# Altium schematic sheet INF_Pro_Interface.SchDoc
size A4; Author: Yaokun/Felix Zhang; Organization: Altium Limited; Address1: 21A144; Address2: Harbin Engineering University; Address3: Harbin; Address4: CHINA
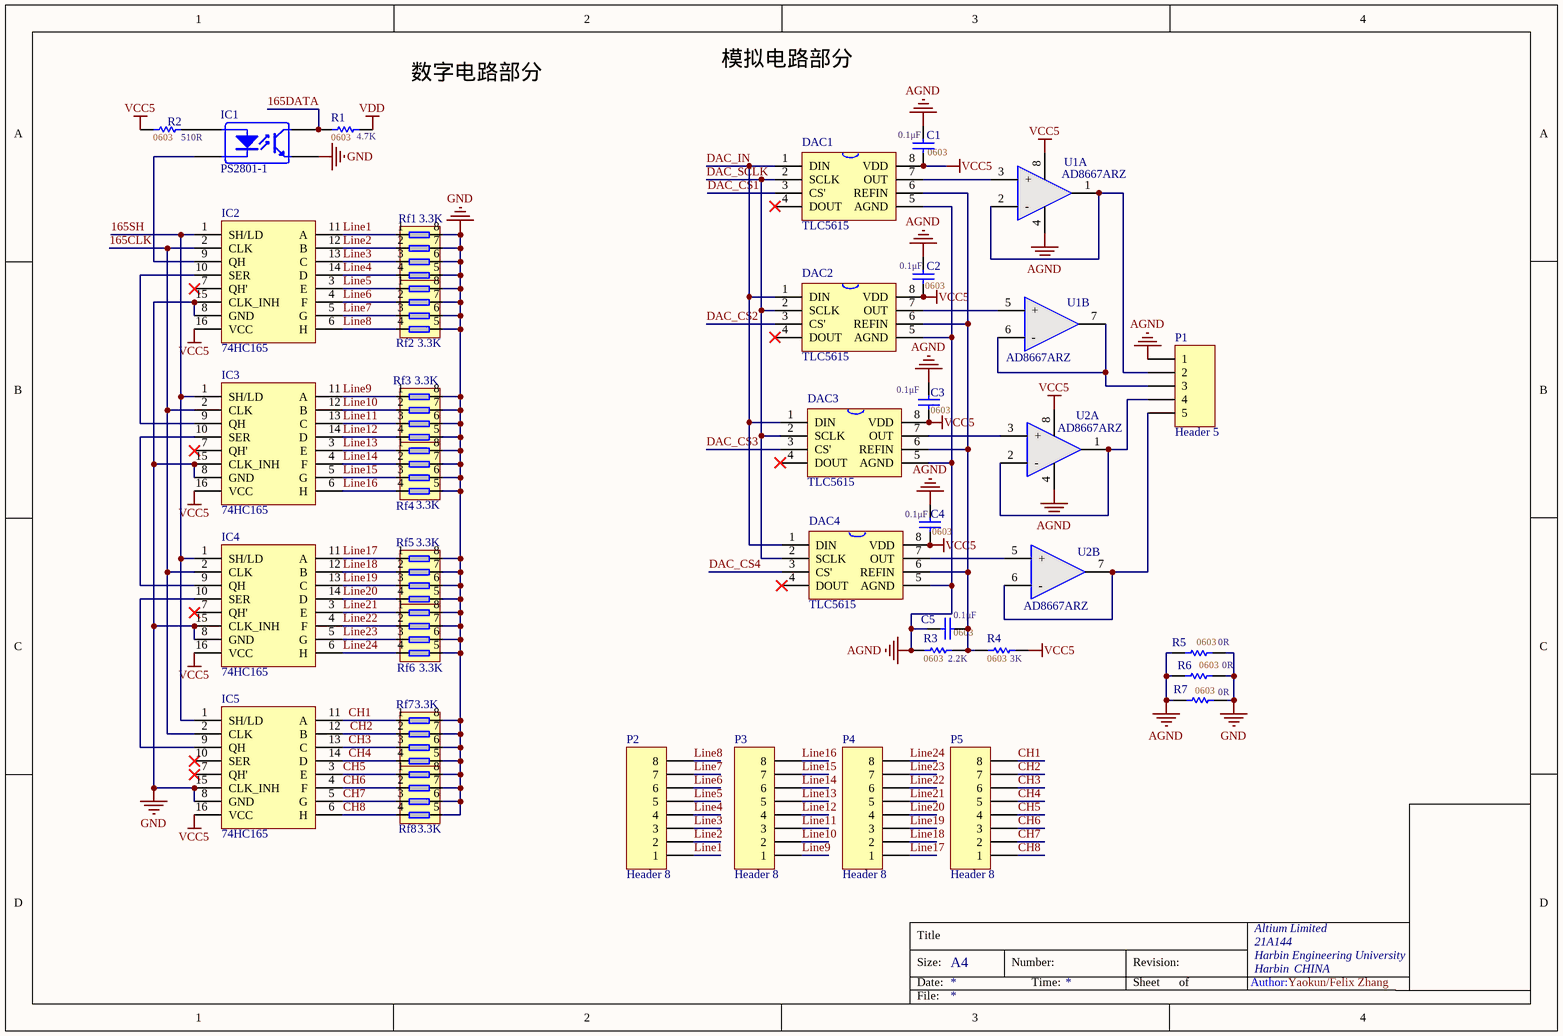
[diagram p0: INF_Pro_Interface.SchDoc]

## Parts
C1  value 0.1μF  [CAP_0603_16*08]  (hidden comment: 0603)
C2  value 0.1μF  [CAP_0603_16*08]  (hidden comment: 0603)
C3  value 0.1μF  [CAP_0603_16*08]  (hidden comment: 0603)
C4  value 0.1μF  [CAP_0603_16*08]  (hidden comment: 0603)
C5  value 0.1μF  [CAP_0603_16*08]  (hidden comment: 0603)
DAC1  TLC5615  [DIP-8]
DAC2  TLC5615  [DIP-8]
DAC3  TLC5615  [DIP-8]
DAC4  TLC5615  [DIP-8]
IC1  PS2801-1  [DIP-4]
IC2  74HC165  [DIP-16]
IC3  74HC165  [DIP-16]
IC4  74HC165  [DIP-16]
IC5  74HC165  [DIP-16]
P1  Header 5  [P5_OUT]
P2  Header 8  [P8_OUT]
P3  Header 8  [P8_OUT]
P4  Header 8  [P8_OUT]
P5  Header 8  [P8_OUT]
R1  value 4.7K  PackageReference: 0603  [RES_0805_20*12]  (hidden comment: SMD)
R2  value 510R  PackageReference: 0603  [RES_0805_20*12]  (hidden comment: SMD)
R3  value 2.2K  PackageReference: 0603  [RES_0805_20*12]  (hidden comment: SMD)
R4  value 3K  PackageReference: 0603  [RES_0805_20*12]  (hidden comment: SMD)
R5  value 0R  PackageReference: 0603  [RES_0805_20*12]  (hidden comment: SMD)
R6  value 0R  PackageReference: 0603  [RES_0805_20*12]  (hidden comment: SMD)
R7  value 0R  PackageReference: 0603  [RES_0805_20*12]  (hidden comment: SMD)
Rf1  3.3K  [RES_FOUR_0603]
Rf2  3.3K  [RES_FOUR_0603]
Rf3  3.3K  [RES_FOUR_0603]
Rf4  3.3K  [RES_FOUR_0603]
Rf5  3.3K  [RES_FOUR_0603]
Rf6  3.3K  [RES_FOUR_0603]
Rf7  3.3K  [RES_FOUR_0603]
Rf8  3.3K  [RES_FOUR_0603]
U1  AD8667ARZ  [DIP-8]  (parts A,B of 2)
U2  AD8667ARZ  [DIP-8]  (parts A,B of 2)

## Nets
AGND: C1.2 C2.2 C3.2 C4.2 C5.1 DAC1.5(AGND) DAC2.5(AGND) DAC3.5(AGND) DAC4.5(AGND) P1.1 R3.2 R5.1 R6.1 R7.1 U1.4(V-) U2.4(V-)
GND: IC1.3 IC2.8(GND) IC2.15(CLK_INH) IC3.8(GND) IC3.15(CLK_INH) IC4.8(GND) IC4.15(CLK_INH) IC5.8(GND) IC5.15(CLK_INH) R5.2 R6.2 R7.2 Rf1.5 Rf1.6 Rf1.7 Rf1.8 Rf2.5 Rf2.6 Rf2.7 Rf2.8 Rf3.5 Rf3.6 Rf3.7 Rf3.8 Rf4.5 Rf4.6 Rf4.7 Rf4.8 Rf5.5 Rf5.6 Rf5.7 Rf5.8 Rf6.5 Rf6.6 Rf6.7 Rf6.8 Rf7.5 Rf7.6 Rf7.7 Rf7.8 Rf8.5 Rf8.6 Rf8.7 Rf8.8
VCC5: C1.1 C2.1 C3.1 C4.1 DAC1.8(VDD) DAC2.8(VDD) DAC3.8(VDD) DAC4.8(VDD) IC2.16(VCC) IC3.16(VCC) IC4.16(VCC) IC5.16(VCC) R2.1 R4.1 U1.8(V+) U2.8(V+)
VDD: R1.2
165CLK: IC2.2(CLK) IC3.2(CLK) IC4.2(CLK) IC5.2(CLK)
165DATA: IC1.4 R1.1
165SH: IC2.1(SH/LD) IC3.1(SH/LD) IC4.1(SH/LD) IC5.1(SH/LD)
CH1: IC5.11(A) P5.8 Rf7.1
CH2: IC5.12(B) P5.7 Rf7.2
CH3: IC5.13(C) P5.6 Rf7.3
CH4: IC5.14(D) P5.5 Rf7.4
CH5: IC5.3(E) P5.4 Rf8.1
CH6: IC5.4(F) P5.3 Rf8.2
CH7: IC5.5(G) P5.2 Rf8.3
CH8: IC5.6(H) P5.1 Rf8.4
DAC_CS1: DAC1.3(CS')
DAC_CS2: DAC2.3(CS')
DAC_CS3: DAC3.3(CS')
DAC_CS4: DAC4.3(CS')
DAC_IN: DAC1.1(DIN) DAC2.1(DIN) DAC3.1(DIN) DAC4.1(DIN)
DAC_SCLK: DAC1.2(SCLK) DAC2.2(SCLK) DAC3.2(SCLK) DAC4.2(SCLK)
Line1: IC2.11(A) P2.1 Rf1.1
Line2: IC2.12(B) P2.2 Rf1.2
Line3: IC2.13(C) P2.3 Rf1.3
Line4: IC2.14(D) P2.4 Rf1.4
Line5: IC2.3(E) P2.5 Rf2.1
Line6: IC2.4(F) P2.6 Rf2.2
Line7: IC2.5(G) P2.7 Rf2.3
Line8: IC2.6(H) P2.8 Rf2.4
Line9: IC3.11(A) P3.1 Rf3.1
Line10: IC3.12(B) P3.2 Rf3.2
Line11: IC3.13(C) P3.3 Rf3.3
Line12: IC3.14(D) P3.4 Rf3.4
Line13: IC3.3(E) P3.5 Rf4.1
Line14: IC3.4(F) P3.6 Rf4.2
Line15: IC3.5(G) P3.7 Rf4.3
Line16: IC3.6(H) P3.8 Rf4.4
Line17: IC4.11(A) P4.1 Rf5.1
Line18: IC4.12(B) P4.2 Rf5.2
Line19: IC4.13(C) P4.3 Rf5.3
Line20: IC4.14(D) P4.4 Rf5.4
Line21: IC4.3(E) P4.5 Rf6.1
Line22: IC4.4(F) P4.6 Rf6.2
Line23: IC4.5(G) P4.7 Rf6.3
Line24: IC4.6(H) P4.8 Rf6.4
NetC5_2: C5.2 DAC1.6(REFIN) DAC2.6(REFIN) DAC3.6(REFIN) DAC4.6(REFIN) R3.1 R4.2
NetDAC1_7: DAC1.7(OUT) U1.3(+)
NetDAC2_7: DAC2.7(OUT) U1.5(+)
NetDAC3_7: DAC3.7(OUT) U2.3(+)
NetDAC4_7: DAC4.7(OUT) U2.5(+)
NetIC1_1: IC1.1 R2.2
NetIC1_2: IC1.2 IC2.9(QH)
NetIC2_10: IC2.10(SER) IC3.9(QH)
NetIC3_10: IC3.10(SER) IC4.9(QH)
NetIC4_10: IC4.10(SER) IC5.9(QH)
NetP1_2: P1.2 U1.1(OUT1) U1.2(-)
NetP1_3: P1.3 U1.6(-) U1.7(OUT2)
NetP1_4: P1.4 U2.1(OUT1) U2.2(-)
NetP1_5: P1.5 U2.6(-) U2.7(OUT2)

Not connected (* = marked no-connect by the designer): DAC1 4(DOUT)*; DAC2 4(DOUT)*; DAC3 4(DOUT)*; DAC4 4(DOUT)*; IC2 7(QH')*; IC3 7(QH')*; IC4 7(QH')*; IC5 7(QH')* 10(SER)*

## Notes on the sheet
- 数字电路部分
- 模拟电路部分
- Title
- Size:
- Date:
- A4
- Number:
- Time:
- Revision:
- Sheet
- of
- Author:
- File:

## Library data of the parts
C1-C5 = Cap: Capacitor; Published: 8-Jun-2000; LatestRevisionDate: 17-Jul-2002; LatestRevisionNote: Re-released for DXP Platform.; Publisher: Altium Limited; PackageDescription: 0603; PackageReference: 0603
DAC1-DAC4 = TLC5616_DAC
P1 = Header 5: Header, 5-Pin; LatestRevisionDate: 17-Jul-2002; LatestRevisionNote: Re-released for DXP Platform.; Publisher: Altium Limited
P2-P5 = Header 8: Header, 8-Pin; LatestRevisionDate: 17-Jul-2002; LatestRevisionNote: Re-released for DXP Platform.; Publisher: Altium Limited
R1-R7 = RES_SMD: Resistor; Published: 8-Jun-2000; LatestRevisionDate: 17-Jul-2002; LatestRevisionNote: Re-released for DXP Platform.; Publisher: Altium Limited; PackageDescription: SMD
Rf1-Rf8 = RES_4P
U1 U2 = AD8667: 双运放